# EAGLE design Exoskeleton_PCB_v2 (EAGLE 9.6.2)
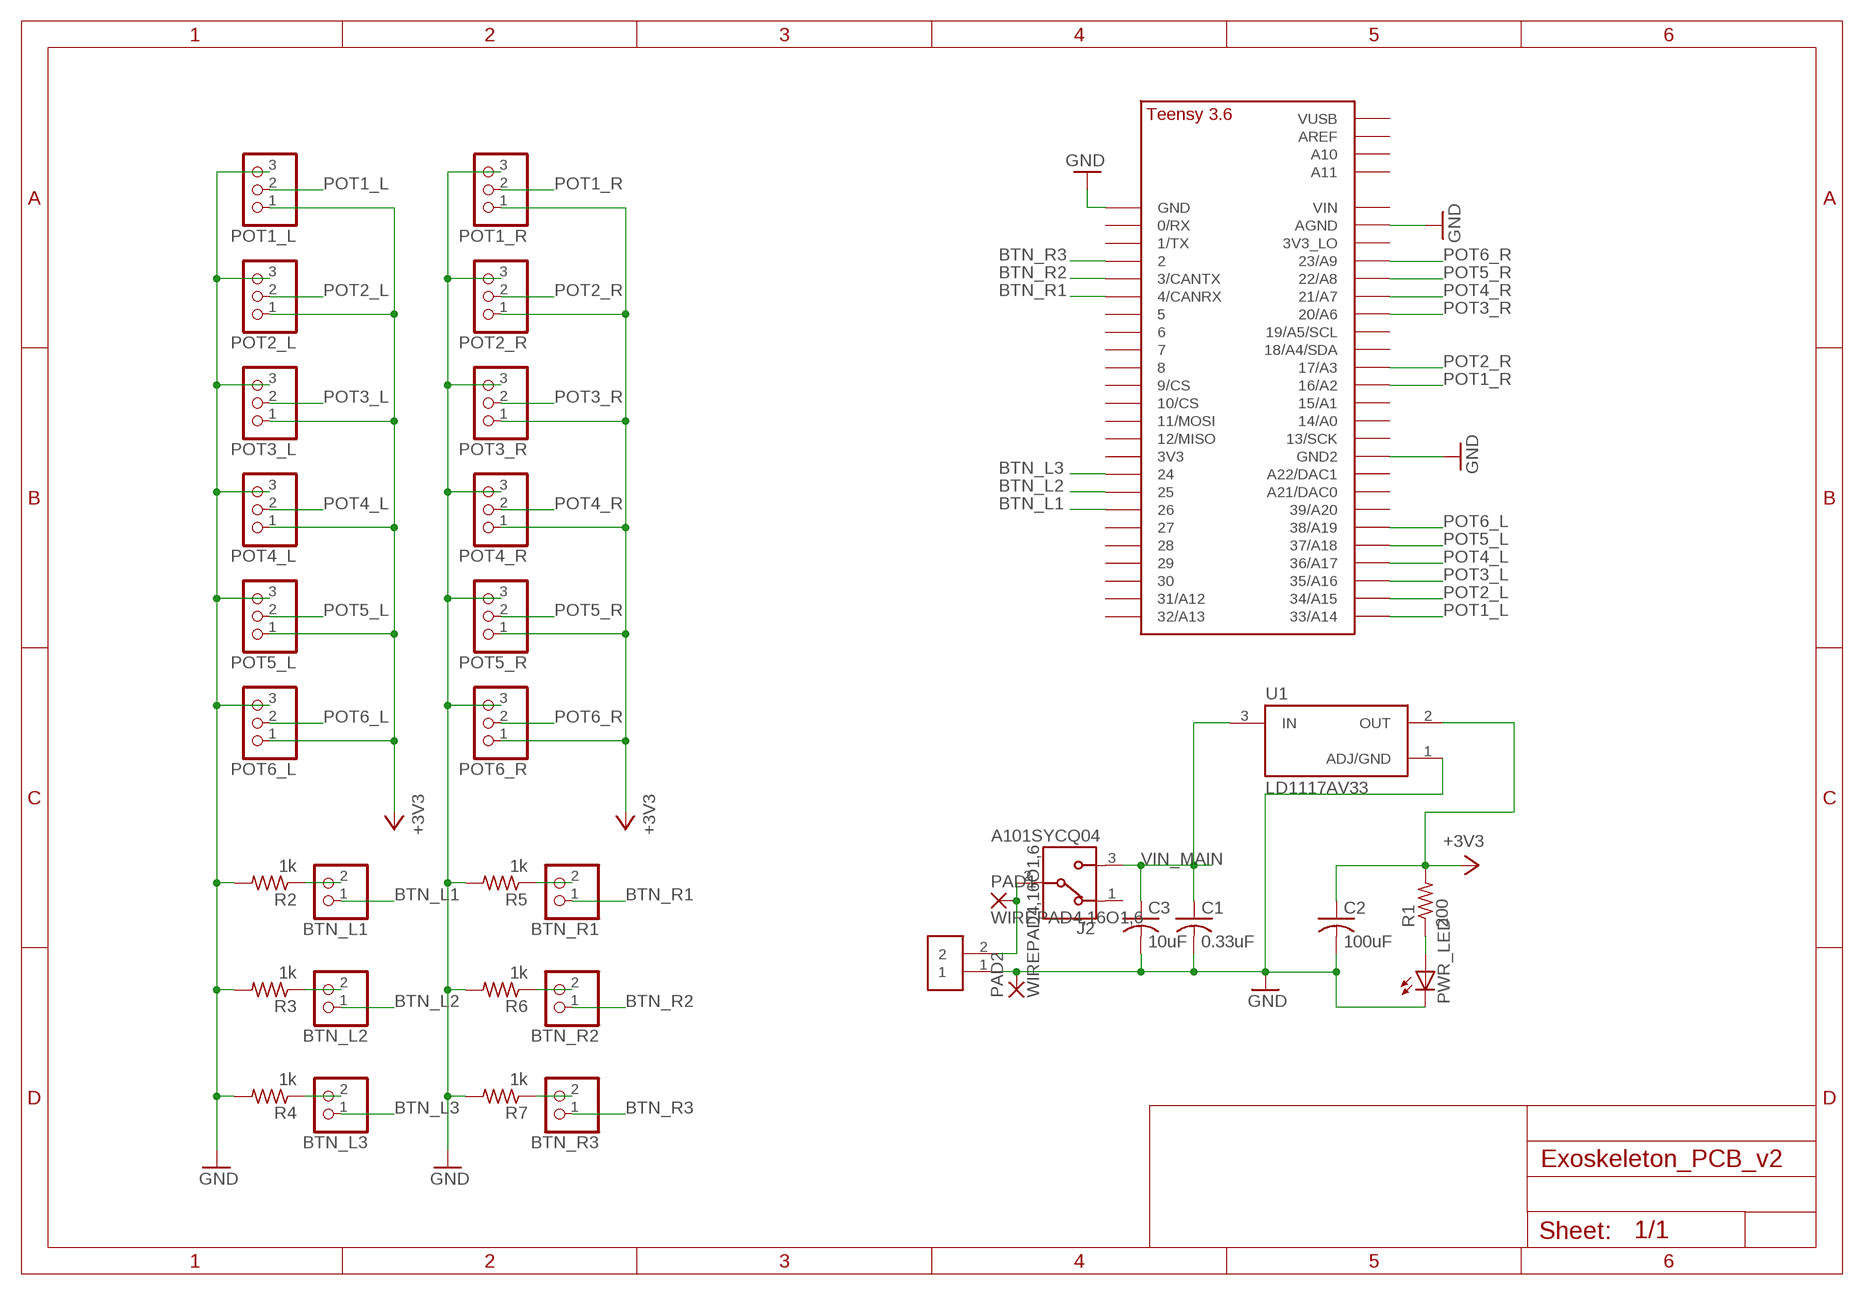
[diagram p0: schematic, sheet 1]

## Parts
BTN_L1  PINHD-1X2  [1X02]
BTN_L2  PINHD-1X2  [1X02]
BTN_L3  PINHD-1X2  [1X02]
BTN_R1  PINHD-1X2  [1X02]
BTN_R2  PINHD-1X2  [1X02]
BTN_R3  PINHD-1X2  [1X02]
C1  0.33uF  C-US050-030X075  [C050-030X075]
C2  100uF  C-US050-030X075  [C050-030X075]
C3  10uF  C-US050-030X075  [C050-030X075]
J1  282837-2  [TE_282837-2]
J2  A101SYCQ04  [TE_A101SYCQ04]
PAD1  WIREPAD4,16O1,6  [4,16O1,6]
PAD2  WIREPAD4,16O1,6  [4,16O1,6]
POT1_L  PINHD-1X3  [1X03]
POT1_R  PINHD-1X3  [1X03]
POT2_L  PINHD-1X3  [1X03]
POT2_R  PINHD-1X3  [1X03]
POT3_L  PINHD-1X3  [1X03]
POT3_R  PINHD-1X3  [1X03]
POT4_L  PINHD-1X3  [1X03]
POT4_R  PINHD-1X3  [1X03]
POT5_L  PINHD-1X3  [1X03]
POT5_R  PINHD-1X3  [1X03]
POT6_L  PINHD-1X3  [1X03]
POT6_R  PINHD-1X3  [1X03]
PWR_LED  LED5MM  [LED5MM]
R1  200  R-US_0207/9  [0207/9]
R2  1k  R-US_0207/9  [0207/9]
R3  1k  R-US_0207/9  [0207/9]
R4  1k  R-US_0207/9  [0207/9]
R5  1k  R-US_0207/9  [0207/9]
R6  1k  R-US_0207/9  [0207/9]
R7  1k  R-US_0207/9  [0207/9]
U1  LD1117AV33  [TO255P1020X450X1968-3]
U$1  TEENSY_3.5/3.6_BASIC  [TEENSY_3.5/3.6_BASIC]

## Nets
+3V3 [PWR]: C2.1 POT1_L.1 POT1_R.1 POT2_L.1 POT2_R.1 POT3_L.1 POT3_R.1 POT4_L.1 POT4_R.1 POT5_L.1 POT5_R.1 POT6_L.1 POT6_R.1 R1.2 U1.2(OUT)
BTN_L1: BTN_L1.1 U$1.26
BTN_L2: BTN_L2.1 U$1.25
BTN_L3: BTN_L3.1 U$1.24
BTN_R1: BTN_R1.1 U$1.4/CANRX
BTN_R2: BTN_R2.1 U$1.3/CANTX
BTN_R3: BTN_R3.1 U$1.2
GND: C1.2 C2.2 C3.2 J1.1 PAD2.1(P) POT1_L.3 POT1_R.3 POT2_L.3 POT2_R.3 POT3_L.3 POT3_R.3 POT4_L.3 POT4_R.3 POT5_L.3 POT5_R.3 POT6_L.3 POT6_R.3 PWR_LED.K(C) R2.2 R3.2 R4.2 R5.2 R6.2 R7.2 U1.1(ADJ/GND) U$1.AGND U$1.GND U$1.GND2
N$1: PWR_LED.A R1.1
N$2: BTN_L1.2 R2.1
N$3: BTN_L3.2 R4.1
N$4: BTN_L2.2 R3.1
N$5: BTN_R1.2 R5.1
N$6: BTN_R2.2 R6.1
N$7: BTN_R3.2 R7.1
N$8: J1.2 J2.2 PAD1.1(P)
POT1_L: POT1_L.2 U$1.33/A14
POT1_R: POT1_R.2 U$1.16/A2
POT2_L: POT2_L.2 U$1.34/A15
POT2_R: POT2_R.2 U$1.17/A3
POT3_L: POT3_L.2 U$1.35/A16
POT3_R: POT3_R.2 U$1.20/A6
POT4_L: POT4_L.2 U$1.36/A17
POT4_R: POT4_R.2 U$1.21/A7
POT5_L: POT5_L.2 U$1.37/A18
POT5_R: POT5_R.2 U$1.22/A8
POT6_L: POT6_L.2 U$1.38/A19
POT6_R: POT6_R.2 U$1.23/A9
VIN_MAIN: C1.1 C3.1 J2.3 U1.3(IN)
Unconnected: J2.1 U$1.0/RX U$1.1/TX U$1.3V3 U$1.3V3_LO U$1.5 U$1.6 U$1.7 U$1.8 U$1.9/CS U$1.10/CS U$1.11/MOSI U$1.12/MISO U$1.13/SCK U$1.14/A0 U$1.15/A1 U$1.18/A4/SDA U$1.19/A5/SCL U$1.21/DAC0(A21/DAC0) U$1.27 U$1.28 U$1.29 U$1.30 U$1.31/A12 U$1.32/A13 U$1.39/A20 U$1.A10 U$1.A11 U$1.A22/DAC1 U$1.AREF U$1.VIN U$1.VUSB

## Library data of the parts
BTN_L1-BTN_L3 BTN_R1-BTN_R3 = pinhead:PINHD-1X2: PIN HEADER
C1-C3 = adafruit:C-US: CAPACITOR, American symbol
J1 = 282837-2:282837-2: TERM BLOCK 5.08MM 2POS SIDE ENTY; AVAILABILITY: Unavailable; COMMENT: 282837-2; DESCRIPTION: Connector Terminal Blocks Receptacle 2 Position 5.08mm Solder Straight Thru-Hole 13.5A/Contact; MF: TE Connectivity; MP: 282837-2; PACKAGE: None; PRICE: None; TE_PURCHASE_URL: https://www.te.com/usa-en/product-282837-2.html?te_bu=Cor&te_type=disp&te_campaign=seda_glo_cor-seda-global-disp-prtnr-fy19-seda-model-bom-cta_sma-317_1&elqCampaignId=32493
J2 = A101SYCQ04:A101SYCQ04: Switch Toggle ON None ON SPDT Long Baton Lever PC Pins 5A 250VAC 28VDC PC Mount with Threads Bulk Check prices <https://snapeda.com/parts/A101SYCQ04/TE%20Connectivity/view-part/?ref=eda>; AVAILABILITY: Warning; COMMENT: 4-1825136-5; DESCRIPTION: Toggle Switch SPDT Panel Mount; MF: TE Connectivity; MOUSER-PURCHASE-URL: https://snapeda.com/shop?store=Mouser&id=293772; MP: A101SYCQ04; PACKAGE: SOIC-8 TE Connectivity; PRICE: None
PAD1 PAD2 = wirepad:WIREPAD: Wire PAD connect wire on PCB
POT1_L POT1_R POT2_L POT2_R POT3_L POT3_R POT4_L POT4_R POT5_L POT5_R POT6_L POT6_R = pinhead:PINHD-1X3: PIN HEADER
PWR_LED = adafruit:LED: LED OSRAM: - CHIPLED LG R971, LG N971, LY N971, LG Q971, LY Q971, LO R971, LY R971 LH N974, LH R974 LS Q976, LO Q976, LY Q976 LO Q996 - Hyper CHIPLED LW Q18S LB Q993, LB Q99A, LB R99A - SideLED LS A670, LO A670, LY A670, LG A670, LP A670 LB A673, LV A673, LT A673, LW A673 LH A674 LY A675 LS A676, LA A676, LO A676, LY A676, LW A676 LS A679, LY A679, LG A679 - Hyper Micro SIDELED® LS Y876, LA Y876, LO Y876, LY Y876 LT Y87S - SmartLED LW L88C, LW L88S LB L89C, LB L89S, LG L890 LS L89K, LO L89K, LY L89K LS L896, LA L896, LO L896, LY L896 - TOPLED LS T670, LO T670, LY T670, LG T670, LP T670 LSG T670, LSP T670, LSY T670, LOP T670, LYG T670 LG T671, LOG T671, LSG T671 LB T673, LV T673, LT T673, LW T673 LH T674 LS T676, LA T676, LO T676, LY T676, LB T676, LH T676, LSB T676, LW T676 LB T67C, LV T67C, LT T67C, LS T67K, LO T67K, LY T67K, LW E67C LS E67B, LA E67B, LO E67B, LY E67B, LB E67C, LV E67C, LT E67C LW T67C LS T679, LY T679, LG T679 LS T770, LO T770, LY T770, LG T770, LP T770 LB T773, LV T773, LT T773, LW T773 LH T774 LS E675, LA E675, LY E675, LS T675 LS T776, LA T776, LO T776, LY T776, LB T776 LHGB T686 LT T68C, LB T68C - Hyper Mini TOPLED® LB M676 - Mini TOPLED Santana® LG M470 LS M47K, LO M47K, LY M47K Source: http://www.osram.convergy.de/
R1-R7 = adafruit:R-US_: RESISTOR, American symbol
U1 = LD1117AV33:LD1117AV33: Linear Voltage Regulator IC 1 Output 1A TO-220AB Check prices <https://pricing.snapeda.com/parts/LD1117AV33/STMicroelectronics/view-part?ref=eda>; AVAILABILITY: Good; DESCRIPTION: Linear Voltage Regulator IC 1 Output 1A TO-220AB; MF: STMicroelectronics; MP: LD1117AV33; PACKAGE: TO-220 STMicroelectronics; PRICE: None; PURCHASE-URL: https://pricing.snapeda.com/search/part/LD1117AV33/?ref=eda
U$1 = Teensy356:TEENSY_3.5/3.6_BASIC

## Net classes
0 default: width 0.254 mm
1 PWR: width 1.27 mm, clearance 0.254 mm

## Board
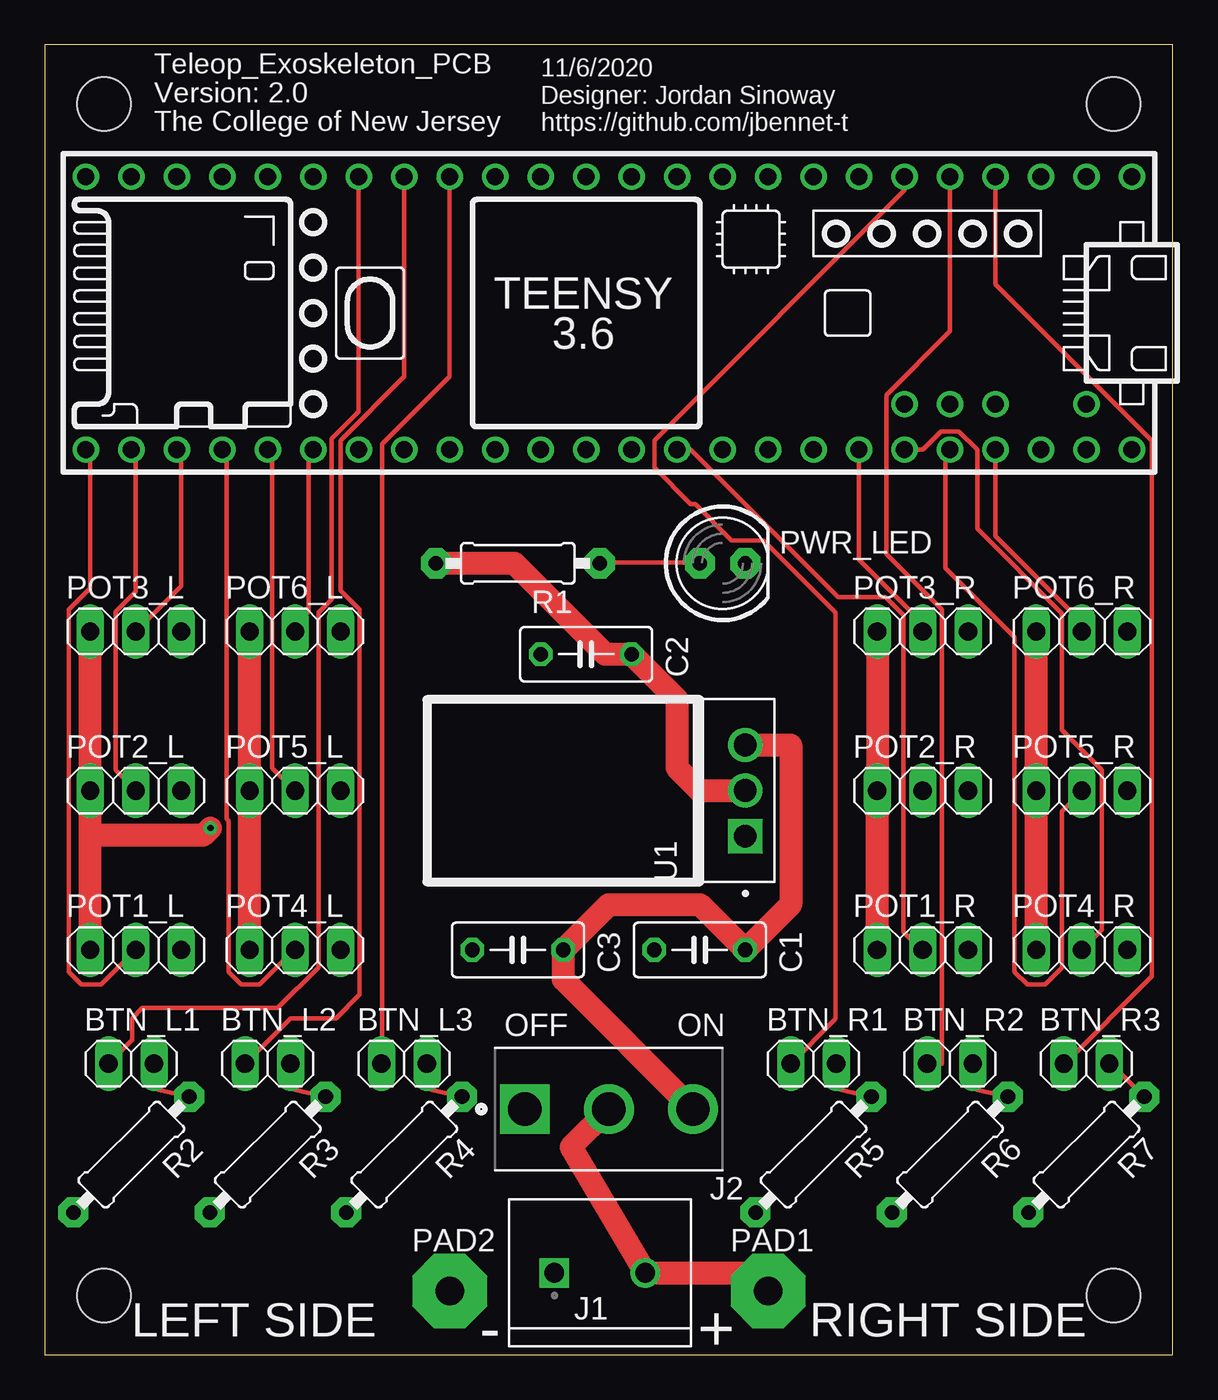
[diagram p1: board, top side]
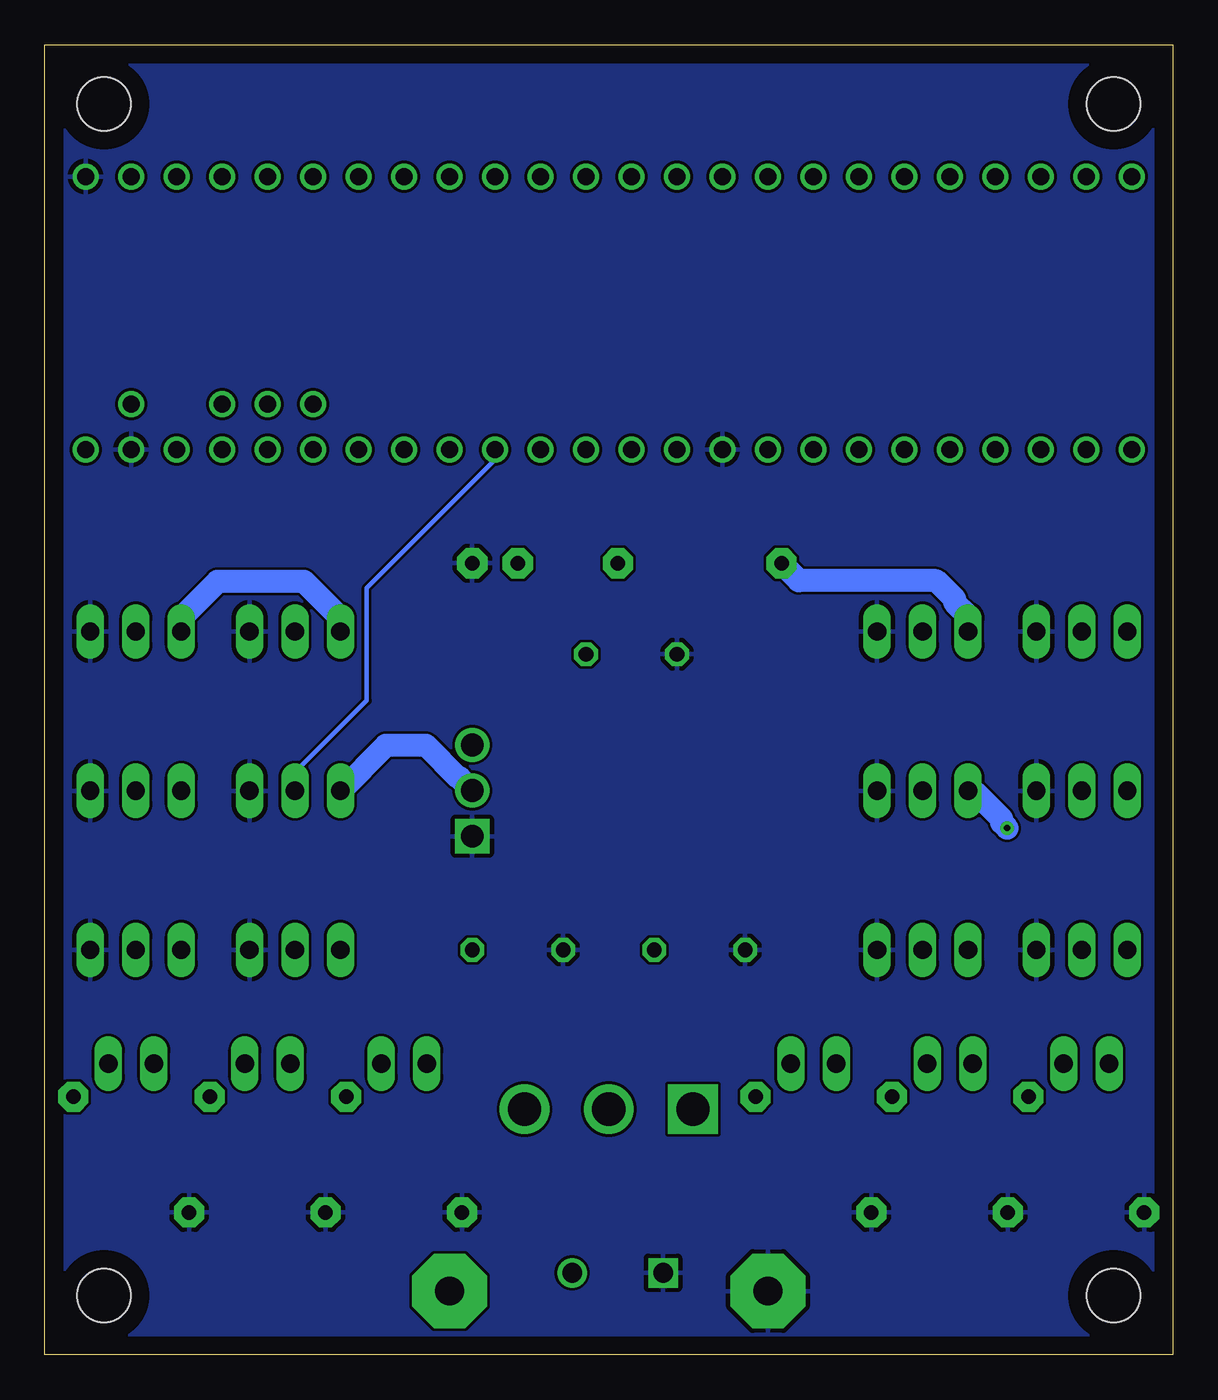
[diagram p2: board, bottom side, seen from below]

Size 63 x 73.15 mm. Coordinates in mm from the lower left corner, seen from the top.
Outline: 63,73.15 0,73.15 0,0 63,0 63,73.15
Copper layers (1*16): Top 0.035mm / dielectric 1.5mm / Bottom 0.035mm
Design rules "default": minimum track width 6mil, minimum drill 0.35mm, track to track 6mil, track to pad 6mil, pad to pad 6mil, via to via 6mil, smd to smd 6mil, copper to edge 40mil, drill to drill 6mil, minimum pad ring 10mil, minimum via ring 8mil, stop-mask expansion 4mil, vias tented up to drill 0mil, thermal gap 10mil
Holes 3 mm at 3.31,3.3 59.7,3.3 59.7,69.85 3.31,69.85

### Footprints (pad centres in the part's own frame; a part is rotated, then mirrored left to right if it is on the bottom)
1X02 = drill 1.016 long: 1 -1.27,0; 2 1.27,0
C050-030X075 = drill 0.813 octagon: 1 -2.54,0; 2 2.54,0
TE_282837-2 = drill 1.1 square: 1 -2.54,0 | drill 1.1: 2 2.54,0
TE_A101SYCQ04 = drill 1.854 square: 1 -4.699,0 | drill 1.854: 2 0,0; 3 4.699,0
4,16O1,6 = drill 1.6 pad 4.166 octagon: 1 0,0
1X03 = drill 1.016 long: 1 -2.54,0; 2 0,0; 3 2.54,0
LED5MM = drill 0.813 pad 1.676 octagon: A -1.27,0; K 1.27,0
0207/9 = drill 0.813 pad 1.676 octagon: 1 -4.572,0; 2 4.572,0
TO255P1020X450X1968-3 = drill 1.27 pad 1.91 square: 1 0,0 | drill 1.27 pad 1.91: 2 2.55,0; 3 5.1,0
TEENSY_3.5/3.6_BASIC = drill 0.965: 0/RX -25.4,-7.62; 1/TX -22.86,-7.62; 2 -20.32,-7.62; 3/CANTX -17.78,-7.62; 3V3 7.62,-7.62; 3V3_LO -22.86,7.62; 4/CANRX -15.24,-7.62; 5 -12.7,-7.62; 6 -10.16,-7.62; 7 -7.62,-7.62; 8 -5.08,-7.62; 9/CS -2.54,-7.62; 10/CS 0,-7.62; 11/MOSI 2.54,-7.62; 12/MISO 5.08,-7.62; 13/SCK 5.08,7.62; 14/A0 2.54,7.62; 15/A1 0,7.62; 16/A2 -2.54,7.62; 17/A3 -5.08,7.62; 18/A4/SDA -7.62,7.62; 19/A5/SCL -10.16,7.62; 20/A6 -12.7,7.62; 21/A7 -15.24,7.62; 21/DAC0 12.7,7.62; 22/A8 -17.78,7.62; 23/A9 -20.32,7.62; 24 10.16,-7.62; 25 12.7,-7.62; 26 15.24,-7.62; 27 17.78,-7.62; 28 20.32,-7.62; 29 22.86,-7.62; 30 25.4,-7.62; 31/A12 27.94,-7.62; 32/A13 30.48,-7.62; 33/A14 30.48,7.62; 34/A15 27.94,7.62; 35/A16 25.4,7.62; 36/A17 22.86,7.62; 37/A18 20.32,7.62; 38/A19 17.78,7.62; 39/A20 15.24,7.62; A10 -17.78,5.08; A11 -15.24,5.08; A22/DAC1 10.16,7.62; AGND -25.4,7.62; AREF -20.32,5.08; GND -27.94,-7.62; GND2 7.62,7.62; VIN -27.94,7.62; VUSB -25.4,5.08

### Placement (x,y rotation side)
BTN_L1  4.83,16.26 0 top
BTN_L2  12.45,16.26 0 top
BTN_L3  20.07,16.26 0 top
BTN_R1  42.93,16.26 0 top
BTN_R2  50.55,16.26 0 top
BTN_R3  58.17,16.26 0 top
C1  36.58,22.61 180 top
C2  30.23,39.12 180 top
C3  26.42,22.61 180 top
J1  31,4.57 0 top
J2  31.5,13.72 0 top
PAD1  40.39,3.56 0 top
PAD2  22.61,3.56 0 top
POT1_L  5.09,22.61 0 top
POT1_R  49.03,22.61 0 top
POT2_L  5.09,31.5 0 top
POT2_R  49.03,31.5 0 top
POT3_L  5.09,40.39 0 top
POT3_R  49.03,40.39 0 top
POT4_L  13.98,22.61 0 top
POT4_R  57.92,22.61 0 top
POT5_L  13.98,31.5 0 top
POT5_R  57.92,31.5 0 top
POT6_L  13.98,40.39 0 top
POT6_R  57.92,40.39 0 top
PWR_LED  37.85,44.2 0 top
R1  26.42,44.2 180 top
R2  4.83,11.18 225 top
R3  12.45,11.18 225 top
R4  20.07,11.18 225 top
R5  42.93,11.18 225 top
R6  50.55,11.18 225 top
R7  58.17,11.18 225 top
U1  39.12,28.96 90 top
U$1  32.77,58.17 180 top

### Tracks (layer width: path | path; a pad name or v marks a point on that pad's centre or on a via)
+3V3  (via drill 0.35)
  Top 1.27: POT1_R.1 POT2_R.1 POT3_R.1 | POT6_R.1 POT5_R.1 POT4_R.1 | POT1_L.1 2.55,29.01 | 2.55,29.01 POT2_L.1 POT3_L.1 | POT6_L.1 POT5_L.1 POT4_L.1 | 2.55,29.01 8.84,29.01 v9.25,29.41 | R1.2 26.22,44.2 31.3,39.12 C2.1 35.31,36.58 35.31,32.77 36.57,31.51 U1.2
  Bottom 1.27: POT3_R.1 46.49,41.15 48.52,43.18 53.35,43.18 55.38,41.15 POT6_R.1 | v9.25,29.41 9.56,29.72 9.56,29.92 10.98,31.34 11.38,31.34 11.49,31.45 POT5_L.1 | POT6_L.1 11.49,40.39 11.49,41.3 12.2,42.01 12.2,42.22 13.21,43.23 20.88,43.23 R1.2 | POT2_R.1 43.95,34.04 41.71,34.04 39.89,32.21 39.83,32.21 U1.2
BTN_L1
  Top 0.254: U$1.26 17.53,52.68 16.01,51.16 16.01,42.16 15.3,41.45 15.3,21.64 13.01,19.36 5.44,19.36 4.88,18.8 4.88,17.58 BTN_L1.1
BTN_L2
  Top 0.254: U$1.25 20.07,54.61 16.52,51.05 16.52,42.67 17.58,41.61 17.58,22.61 17.58,22.35 17.58,20.12 16.26,18.8 13.72,18.8 BTN_L2.1
BTN_L3
  Top 0.254: U$1.24 22.61,54.61 18.85,50.85 18.85,16.26 BTN_L3.1
BTN_R1
  Top 0.254: U$1.4/CANRX 48.01,65.02 34.04,51.05 34.04,49.53 36.07,47.5 36.33,47.5 38.36,45.47 40.14,45.47 44.15,41.45 44.15,18.75 BTN_R1.1
BTN_R2
  Top 0.254: U$1.3/CANTX 50.55,57.15 47,53.59 47,44.7 50.09,41.61 50.09,16.26 BTN_R2.1
BTN_R3
  Top 0.254: U$1.2 53.09,59.79 61.83,51.05 61.83,21.13 56.95,16.26 BTN_R3.1
GND
  pour Bottom: 1.02,72.14 61.98,72.14 61.98,1.02 1.02,1.02
N$1
  Top 0.254: R1.1 31.04,44.25 36.53,44.25 PWR_LED.A
N$2
  Top 0.254: BTN_L1.2 6.1,15.04 6.35,14.79 R2.1
N$3
  Top 0.254: BTN_L3.2 21.34,15.04 21.59,14.79 R4.1
N$4
  Top 0.254: BTN_L2.2 13.72,15.04 13.97,14.79 R3.1
N$5
  Top 0.254: BTN_R1.2 44.2,15.04 44.45,14.79 R5.1
N$6
  Top 0.254: BTN_R2.2 51.82,15.04 52.07,14.79 R6.1
N$7
  Top 0.254: R7.1 59.56,16.26 BTN_R3.2
N$8
  Top 1.27: J2.2 29.39,11.61 J1.2 39.38,4.57 PAD1.1
POT1_L
  Top 0.254: U$1.33/A14 2.55,50.29 2.55,42.82 1.33,41.61 1.33,21.39 2.04,20.68 3.16,20.68 POT1_L.2
POT1_R
  Top 0.254: U$1.16/A2 36.07,50.55 44.3,42.32 46.94,42.32 47.96,41.3 47.96,23.62 48.98,22.61 POT1_R.2
POT2_L
  Top 0.254: U$1.34/A15 5.09,50.29 5.09,42.62 3.97,41.5 3.97,32.66 5.09,31.55 POT2_L.2
POT2_R
  Bottom 0.254: U$1.17/A3 37.85,49.99 45.01,42.82 45.01,36.53 48.98,32.56 48.98,31.55 POT2_R.2
POT3_L
  Top 0.254: U$1.35/A16 7.63,50.29 7.63,42.93 POT3_L.2
POT3_R
  Top 0.254: U$1.20/A6 45.47,44.4 48.98,40.89 48.98,40.39 POT3_R.2
POT4_L
  Top 0.254: U$1.36/A17 10.17,50.29 10.17,29.92 10.27,29.82 10.27,21.39 10.98,20.68 11.99,20.68 13.92,22.61 POT4_L.2
POT4_R
  Top 0.254: U$1.21/A7 49.03,50.55 50.04,51.56 51.06,51.56 52.08,50.55 52.08,46.13 56.8,41.4 56.8,34.9 59.04,32.66 59.04,23.72 POT4_R.2
POT5_L
  Top 0.254: U$1.37/A18 12.71,50.29 12.71,32.77 POT5_L.2
POT5_R
  Top 0.254: U$1.22/A8 50.3,50.29 50.3,43.94 54.16,40.08 54.16,21.39 54.87,20.68 55.89,20.68 56.8,21.59 56.8,30.33 57.92,31.45 POT5_R.2
POT6_L
  Top 0.254: U$1.38/A19 14.74,50.29 14.74,41.5 14.03,40.79 14.03,40.39 POT6_L.2
POT6_R
  Top 0.254: U$1.23/A9 53.09,45.72 57.92,40.89 POT6_R.2
VIN_MAIN
  Top 1.27: J2.3 28.96,20.96 C3.1 31.5,25.15 36.58,25.15 C1.1 41.66,25.15 41.66,34.04 39.14,34.04 U1.3

### Text on the board
tPlace: Teleop_Exoskeleton_PCB / Version: 2.0 / The College of New Jersey | 11/6/2020 / Designer: Jordan Sinoway / https://github.com/jbennet-t | OFF | ON | LEFT SIDE | - | + | RIGHT SIDE